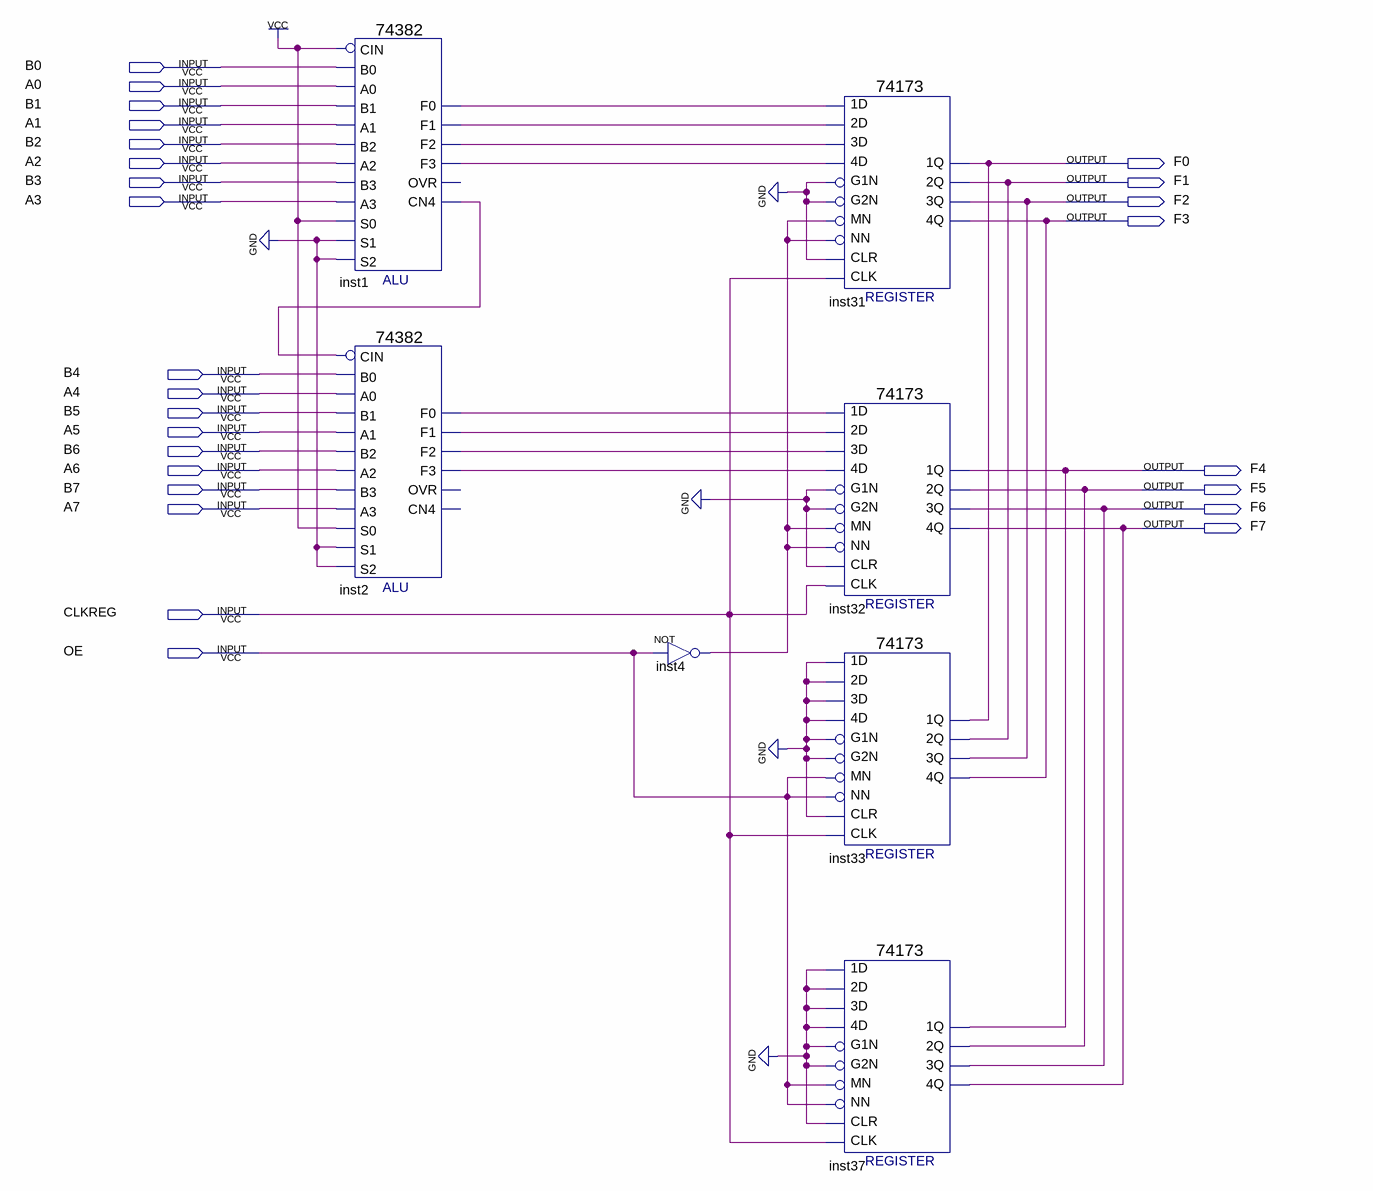
[diagram p0: schematic sheet]
// Quartus schematic Vagas.bdf as structural Verilog: 7 symbols, 26 pins
module Vagas (
  input  B0,
  input  A0,
  input  B1,
  input  A1,
  input  B2,
  input  A2,
  input  B3,
  input  A3,
  input  B4,
  input  A4,
  input  B5,
  input  A5,
  input  B6,
  input  A6,
  input  B7,
  input  A7,
  input  CLKREG,
  input  OE,
  output F0,
  output F1,
  output F2,
  output F3,
  output F4,
  output F5,
  output F6,
  output F7
);

  wire inst1_cn4, inst1_f0, inst1_f1, inst1_f2, inst1_f3, inst2_f0, inst2_f1, inst2_f2, inst2_f3, inst4_out;

  \74382  inst1 (
    .B3(B3), .A3(A3), .B0(B0), .A0(A0), .B1(B1), .S2(1'b0), .S1(1'b0), .S0(1'b1), .A1(A1), .B2(B2), .A2(A2),
    .CIN(1'b1), .F1(inst1_f1), .F0(inst1_f0), .CN4(inst1_cn4), .F3(inst1_f3), .F2(inst1_f2));  // open: OVR
  \74382  inst2 (
    .B3(B7), .A3(A7), .B0(B4), .A0(A4), .B1(B5), .S2(1'b0), .S1(1'b0), .S0(1'b1), .A1(A5), .B2(B6), .A2(A6),
    .CIN(inst1_cn4), .F1(inst2_f1), .F0(inst2_f0), .F3(inst2_f3), .F2(inst2_f2));  // open: CN4, OVR
  not inst4 (inst4_out, OE);
  \74173  inst31 (
    .\3D (inst1_f2), .MN(inst4_out), .\1D (inst1_f0), .\2D (inst1_f1), .\4D (inst1_f3), .G1N(1'b0),
    .G2N(1'b0), .NN(inst4_out), .CLR(1'b0), .CLK(CLKREG), .\3Q (F2), .\2Q (F1), .\1Q (F0), .\4Q (F3));
  \74173  inst32 (
    .\3D (inst2_f2), .MN(inst4_out), .\1D (inst2_f0), .\2D (inst2_f1), .\4D (inst2_f3), .G1N(1'b0),
    .G2N(1'b0), .NN(inst4_out), .CLR(1'b0), .CLK(CLKREG), .\3Q (F6), .\2Q (F5), .\1Q (F4), .\4Q (F7));
  \74173  inst33 (
    .\3D (1'b0), .MN(OE), .\1D (1'b0), .\2D (1'b0), .\4D (1'b0), .G1N(1'b0), .G2N(1'b0), .NN(OE), .CLR(1'b0),
    .CLK(CLKREG), .\3Q (F2), .\2Q (F1), .\1Q (F0), .\4Q (F3));
  \74173  inst37 (
    .\3D (1'b0), .MN(OE), .\1D (1'b0), .\2D (1'b0), .\4D (1'b0), .G1N(1'b0), .G2N(1'b0), .NN(OE), .CLR(1'b0),
    .CLK(CLKREG), .\3Q (F6), .\2Q (F5), .\1Q (F4), .\4Q (F7));
endmodule
